# Altium schematic sheet 03_FT2232-jtag.SchDoc
size A4
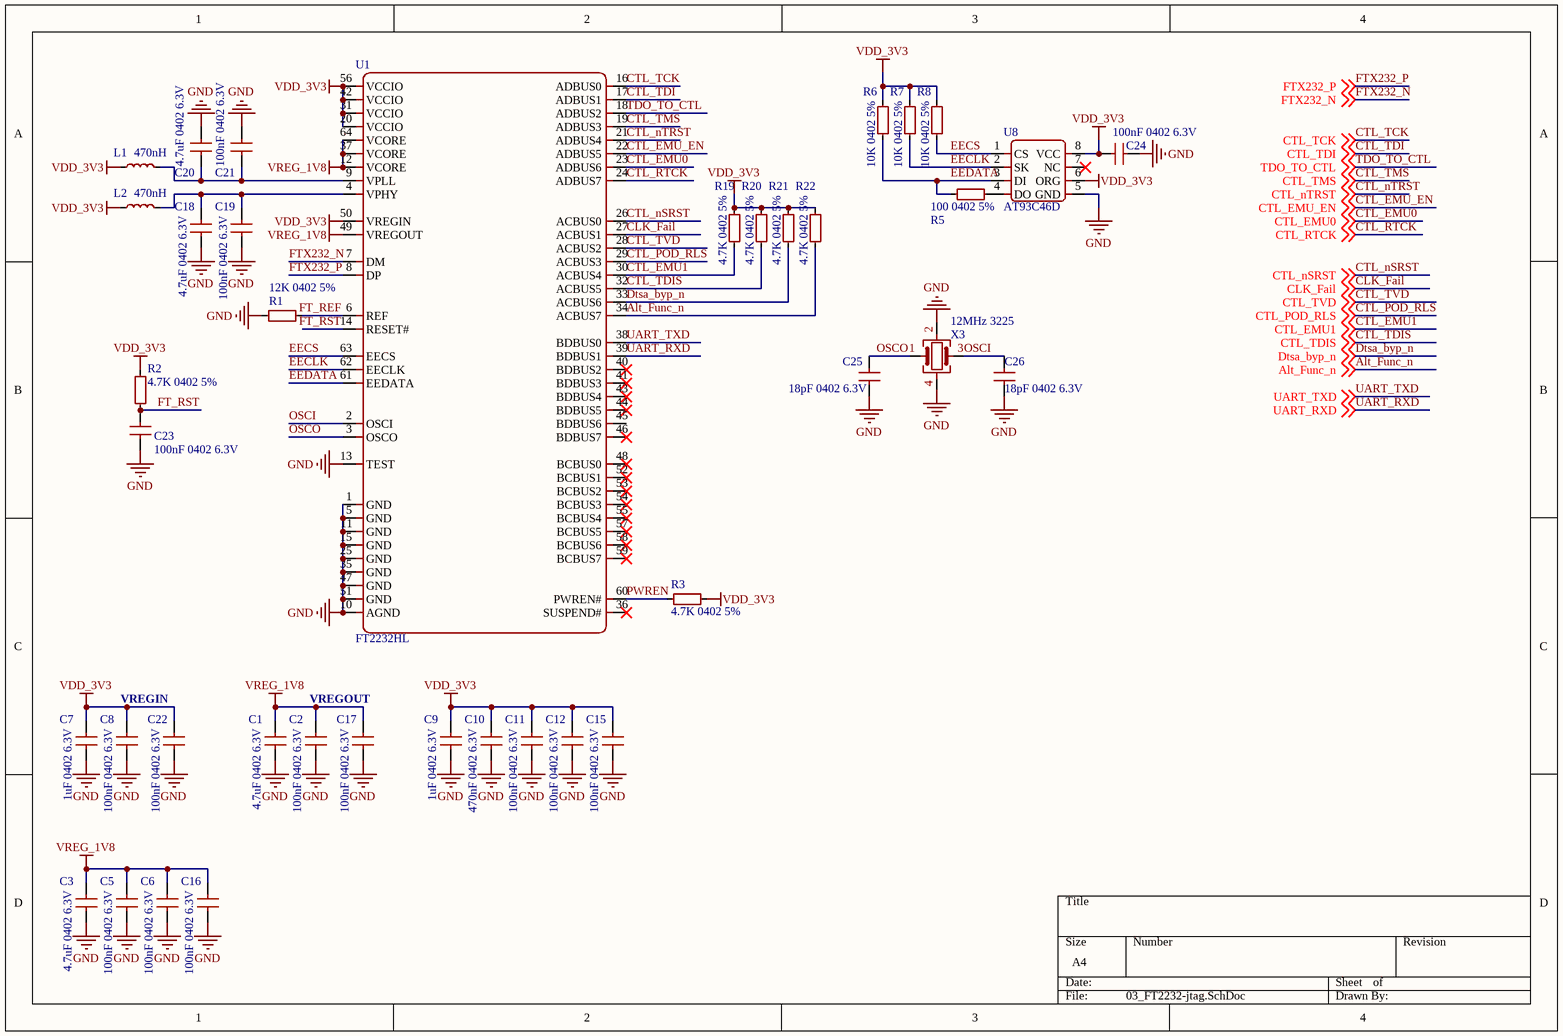
[diagram p0: 03_FT2232-jtag.SchDoc]

## Parts
C1  4.7uF 0402 6.3V  [C_0402_1005Metric]
C2  100nF 0402 6.3V  [C_0402_1005Metric]
C3  4.7uF 0402 6.3V  [C_0402_1005Metric]
C5  100nF 0402 6.3V  [C_0402_1005Metric]
C6  100nF 0402 6.3V  [C_0402_1005Metric]
C7  1uF 0402 6.3V  [C_0402_1005Metric]
C8  100nF 0402 6.3V  [C_0402_1005Metric]
C9  1uF 0402 6.3V  [C_0402_1005Metric]
C10  470nF 0402 6.3V  [C_0402_1005Metric]
C11  100nF 0402 6.3V  [C_0402_1005Metric]
C12  100nF 0402 6.3V  [C_0402_1005Metric]
C15  100nF 0402 6.3V  [C_0402_1005Metric]
C16  100nF 0402 6.3V  [C_0402_1005Metric]
C17  100nF 0402 6.3V  [C_0402_1005Metric]
C18  4.7uF 0402 6.3V  [C_0402_1005Metric]
C19  100nF 0402 6.3V  [C_0402_1005Metric]
C20  100nF 0402 6.3V  [C_0402_1005Metric]
C21  4.7uF 0402 6.3V  [C_0402_1005Metric]
C22  100nF 0402 6.3V  [C_0402_1005Metric]
C23  100nF 0402 6.3V  [C_0402_1005Metric]
C24  100nF 0402 6.3V  [C_0402_1005Metric]
C25  18pF 0402 6.3V  [C_0402_1005Metric]
C26  18pF 0402 6.3V  [C_0402_1005Metric]
L1  470nH  [L0402-SMD]
L2  470nH  [L0402-SMD]
R1  12K 0402 5%  [R_0402_1005Metric]
R2  4.7K 0402 5%  [R_0402_1005Metric]
R3  4.7K 0402 5%  [R_0402_1005Metric]
R5  100 0402 5%  [R_0402_1005Metric]
R6  10K 0402 5%  [R_0402_1005Metric]
R7  10K 0402 5%  [R_0402_1005Metric]
R8  10K 0402 5%  [R_0402_1005Metric]
R19  4.7K 0402 5%  [R_0402_1005Metric]
R20  4.7K 0402 5%  [R_0402_1005Metric]
R21  4.7K 0402 5%  [R_0402_1005Metric]
R22  4.7K 0402 5%  [R_0402_1005Metric]
U1  FT2232HL  [FT2232HL-LQFP-64-HD]
U8  AT93C46D  [AT93C46DN]
X3  12MHz 3225  [Crystal_SMD_3225-4Pin_3.2x2.5mm - duplicate]

## Nets
GND: C1.1 C2.1 C3.1 C5.1 C6.1 C7.1 C8.1 C9.1 C10.1 C11.1 C12.1 C15.1 C16.1 C17.1 C18.1 C19.1 C20.1 C21.1 C22.1 C23.1 C24.2 C25.2 C26.2 R1.1 U1.1(GND) U1.5(GND) U1.10(AGND) U1.11(GND) U1.13(TEST) U1.15(GND) U1.25(GND) U1.35(GND) U1.47(GND) U1.51(GND) U8.5(GND) X3.2 X3.4
VDD_3V3: C7.2 C8.2 C9.2 C10.2 C11.2 C12.2 C15.2 C22.2 C24.1 L1.1 L2.1 R2.1 R3.1 R6.1 R7.1 R8.1 R19.2 R20.2 R21.2 R22.2 U1.20(VCCIO) U1.31(VCCIO) U1.42(VCCIO) U1.50(VREGIN) U1.56(VCCIO) U8.6(ORG) U8.8(VCC)
VREG_1V8: C1.2 C2.2 C3.2 C5.2 C6.2 C16.2 C17.2 U1.12(VCORE) U1.37(VCORE) U1.49(VREGOUT) U1.64(VCORE)
Alt_Func_n: R22.1 U1.34(ACBUS7) ; off-sheet Alt_Func_n
CLK_Fail: U1.27(ACBUS1) ; off-sheet CLK_Fail
CTL_EMU0: U1.23(ADBUS6) ; off-sheet CTL_EMU0
CTL_EMU1: R19.1 U1.30(ACBUS4) ; off-sheet CTL_EMU1
CTL_EMU_EN: U1.22(ADBUS5) ; off-sheet CTL_EMU_EN
CTL_nSRST: U1.26(ACBUS0) ; off-sheet CTL_nSRST
CTL_nTRST: U1.21(ADBUS4) ; off-sheet CTL_nTRST
CTL_POD_RLS: U1.29(ACBUS3) ; off-sheet CTL_POD_RLS
CTL_RTCK: U1.24(ADBUS7) ; off-sheet CTL_RTCK
CTL_TCK: U1.16(ADBUS0) ; off-sheet CTL_TCK
CTL_TDI: U1.17(ADBUS1) ; off-sheet CTL_TDI
CTL_TDIS: R20.1 U1.32(ACBUS5) ; off-sheet CTL_TDIS
CTL_TMS: U1.19(ADBUS3) ; off-sheet CTL_TMS
CTL_TVD: U1.28(ACBUS2) ; off-sheet CTL_TVD
Dtsa_byp_n: R21.1 U1.33(ACBUS6) ; off-sheet Dtsa_byp_n
EECLK: R7.2 U1.62(EECLK) U8.2(SK)
EECS: R8.2 U1.63(EECS) U8.1(CS)
EEDATA: R5.1 R6.2 U1.61(EEDATA) U8.3(DI)
FT_REF: R1.2 U1.6(REF)
FT_RST: C23.2 R2.2 U1.14(RESET#)
FTX232_N: U1.7(DM) ; off-sheet FTX232_N
FTX232_P: U1.8(DP) ; off-sheet FTX232_P
OSCI: C26.1 U1.2(OSCI) X3.3
OSCO: C25.1 U1.3(OSCO) X3.1
PWREN: R3.2 U1.60(PWREN#)
TDO_TO_CTL: U1.18(ADBUS2) ; off-sheet TDO_TO_CTL
UART_RXD: U1.39(BDBUS1) ; off-sheet UART_RXD
UART_TXD: U1.38(BDBUS0) ; off-sheet UART_TXD
NetC18_2: C18.2 C19.2 L2.2 U1.4(VPHY)
NetC20_2: C20.2 C21.2 L1.2 U1.9(VPLL)
NetR5_2: R5.2 U8.4(DO)

Not connected (* = marked no-connect by the designer): U1 36(SUSPEND#)* 40(BDBUS2)* 41(BDBUS3)* 43(BDBUS4)* 44(BDBUS5)* 45(BDBUS6) 46(BDBUS7)* 48(BCBUS0)* 52(BCBUS1)* 53(BCBUS2)* 54(BCBUS3)* 55(BCBUS4)* 57(BCBUS5)* 58(BCBUS6)* 59(BCBUS7)*; U8 7(NC)*

## Notes on the sheet
- VREGIN
- VREGOUT

## Library data of the parts
C1-C3 C5-C12 C15-C26 = C: Unpolarized capacitor
L1 L2 = L: Inductor
R1-R3 R5-R8 R19-R22 = R: Resistor
U1 = FT2232HL: FT2232H Dual High Speed USB to Multipurpose UART/FIFO IC
U8 = AT93C46D: Three-Wire Automotive Temperature Serial EEPROM 1-Kbit
X3 = Crystal-4Pin-Passive-GND24